# Altium schematic sheet Main.SchDoc
size 381 x 381 mm; SheetNumber: 1; SheetTotal: 1
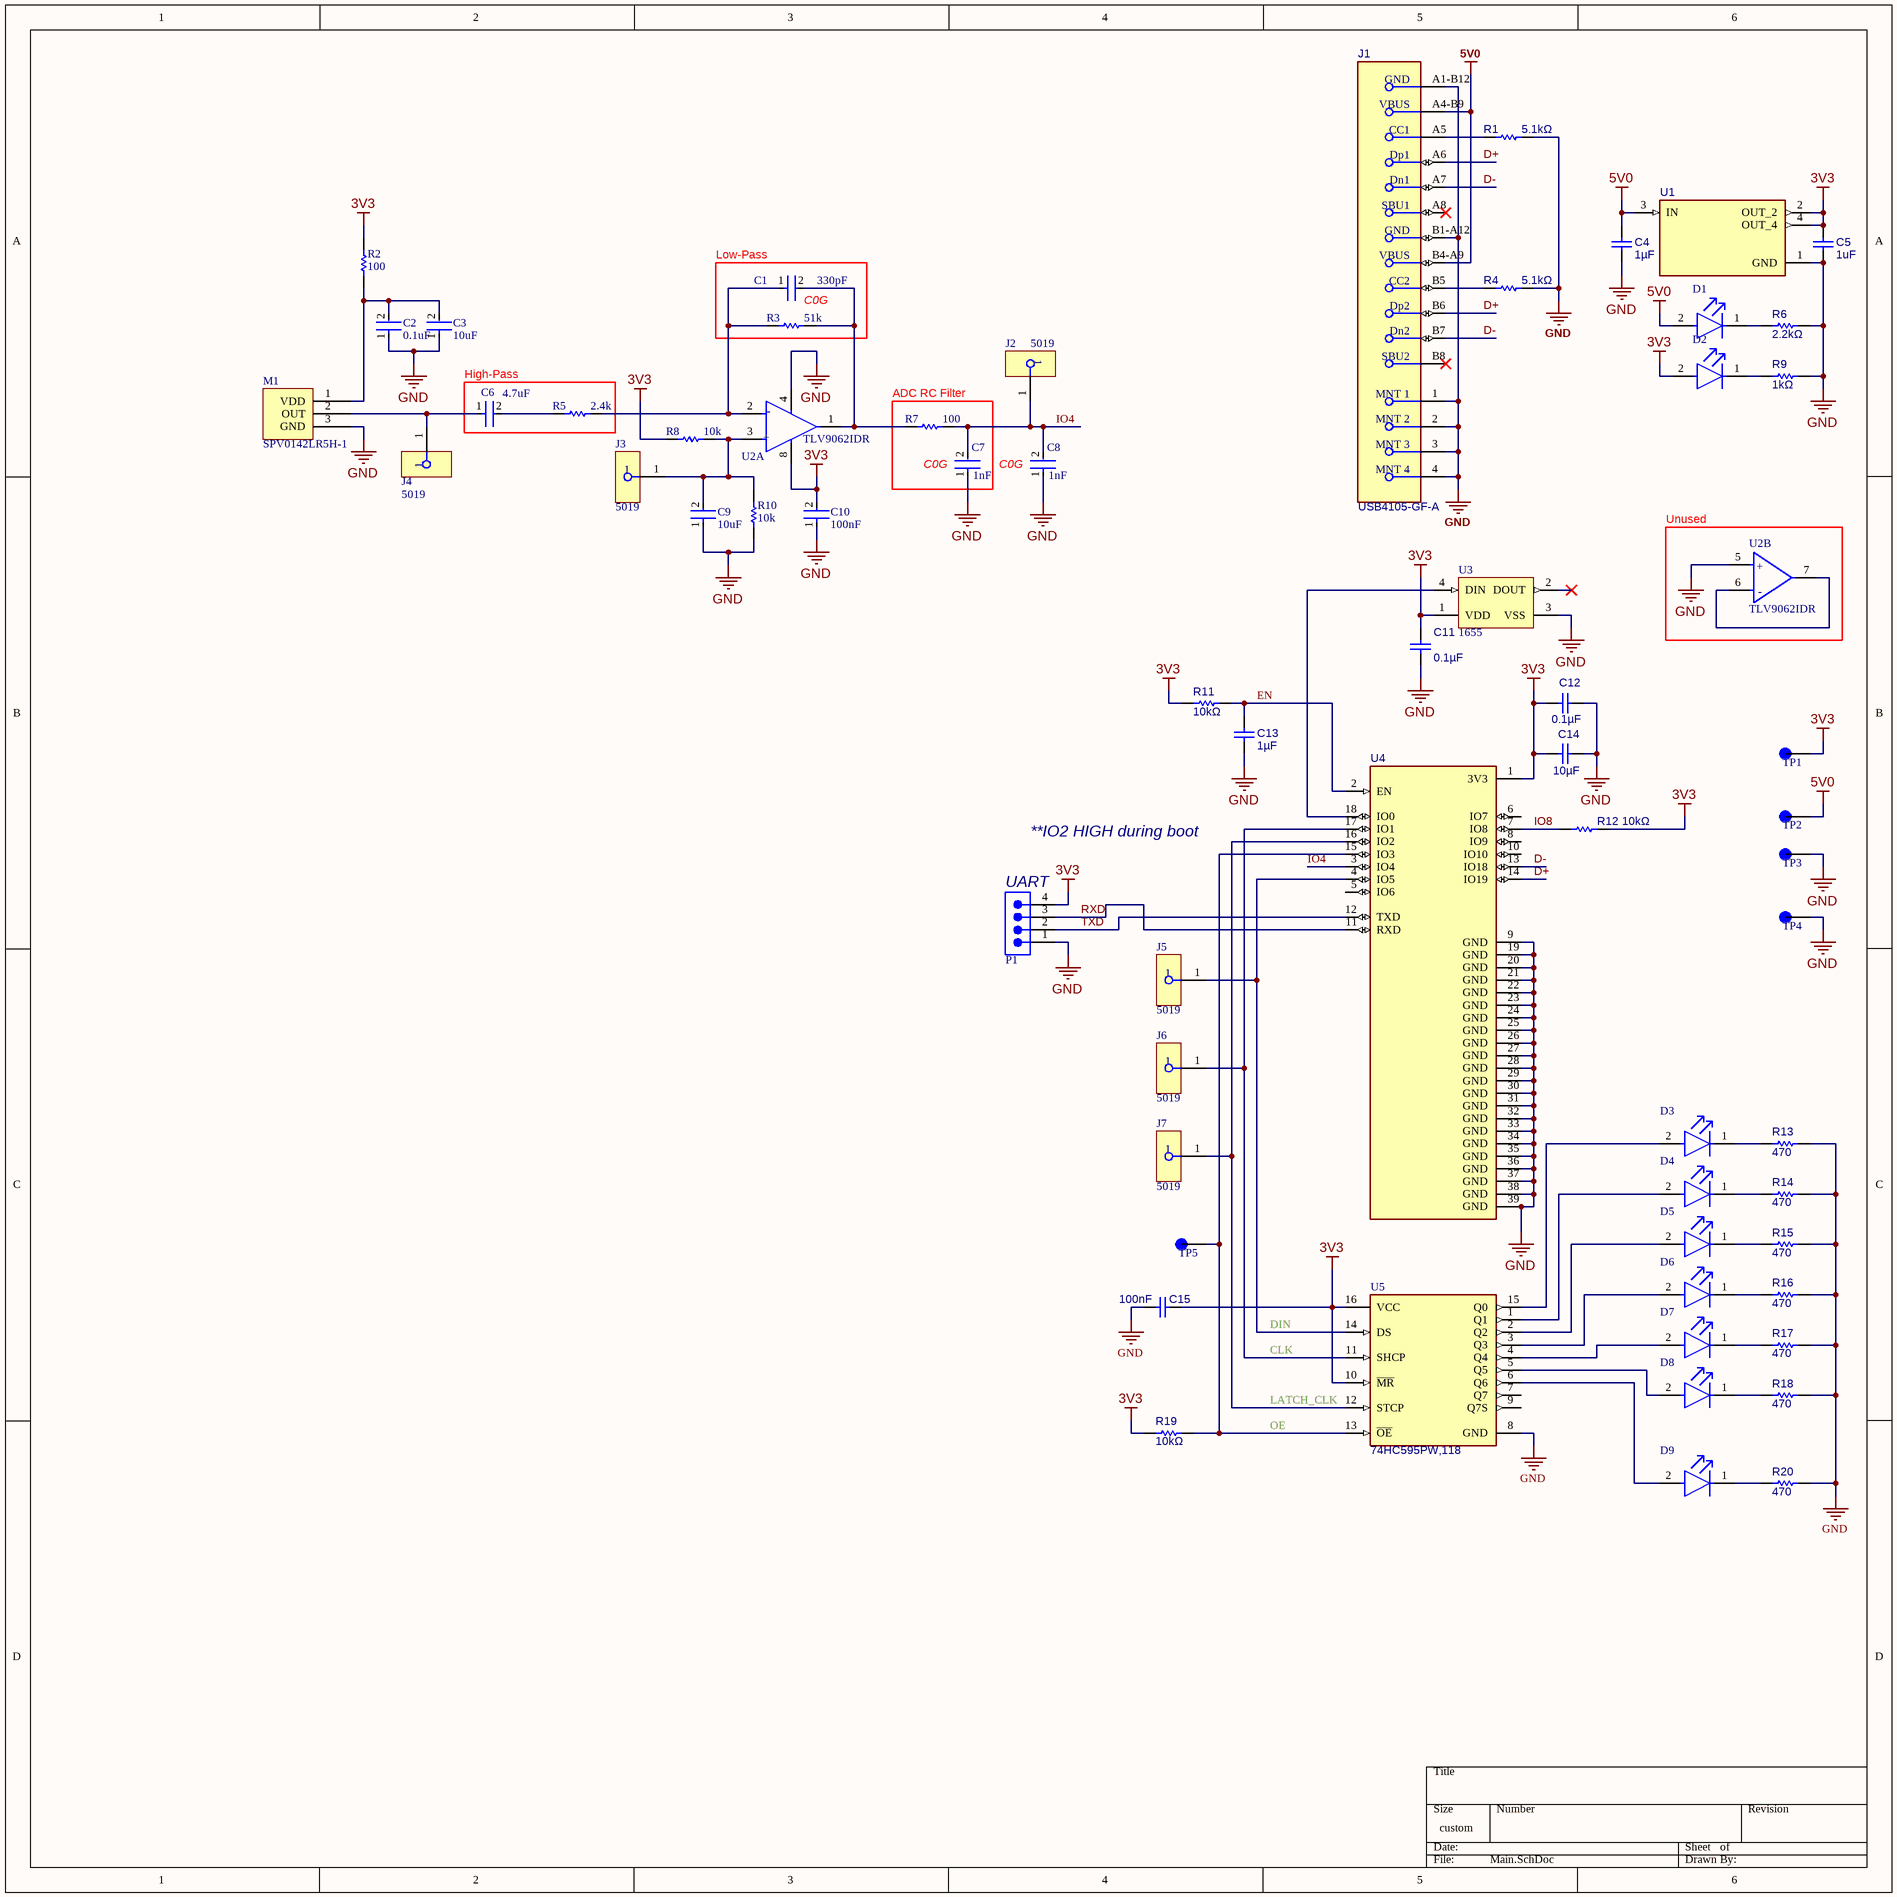
[diagram p0: Main.SchDoc]

## Parts
C1  330pF  [FP-AC1206-0_85-IPC_C]
C2  0.1uF  [FP-AC1206-0_85-IPC_C]
C3  10uF  [FP-AC1206-0_85-IPC_C]
C4  1µF  [WCAP-CSGP_0603_L1.6W0.8H0.8_Reflow]
C5  1uF  [WCAP-CSGP_0603_L1.6W0.8H0.8_Reflow]
C6  4.7uF  [FP-AC1206-0_85-IPC_C]
C7  1nF  [FP-AC1206-0_85-IPC_C]
C8  1nF  [FP-AC1206-0_85-IPC_C]
C9  10uF  [FP-AC1206-0_85-IPC_C]
C10  100nF  [FP-AC1206-0_85-IPC_C]
C11  0.1µF  [WCAP-CSGP_0603_L1.6W0.8H0.8_Reflow]
C12  0.1µF  [WCAP-CSGP_0603_L1.6W0.8H0.8_Reflow]
C13  1µF  [WCAP-CSGP_0603_L1.6W0.8H0.8_Reflow]
C14  10µF  [WCAP-CSGP_0603_L1.6W0.8H0.8_Reflow]
C15  100nF  [WCAP-CSGP_0603_L1.6W0.8H0.8_Reflow]
D1  LTST-C190KGKT  [FP-LTST-C190KGKT-MFG]  (value not drawn)
D2  LTST-C190KGKT  [FP-LTST-C190KGKT-MFG]  (value not drawn)
D3  LTST-C190KGKT  [FP-LTST-C190KGKT-MFG]  (value not drawn)
D4  LTST-C190KGKT  [FP-LTST-C190KGKT-MFG]  (value not drawn)
D5  LTST-C190KGKT  [FP-LTST-C190KGKT-MFG]  (value not drawn)
D6  LTST-C190KGKT  [FP-LTST-C190KGKT-MFG]  (value not drawn)
D7  LTST-C190KGKT  [FP-LTST-C190KGKT-MFG]  (value not drawn)
D8  LTST-C190KGKT  [FP-LTST-C190KGKT-MFG]  (value not drawn)
D9  LTST-C190KGKT  [FP-LTST-C190KGKT-MFG]  (value not drawn)
J1  USB4105-GF-A  [FP-USB4105-GF-A-MFG]
J2  5019  [5019_MFG]
J3  5019  [5019_MFG]
J4  5019  [5019_MFG]
J5  5019  [5019_MFG]
J6  5019  [5019_MFG]
J7  5019  [5019_MFG]
M1  SPV0142LR5H-1  [SPV0142LR5H-1]
P1  61300411121  [61300411121]  (value not drawn)
R1  5.1kΩ  [RESC1608X55X25NL10T15]
R2  100  [RESC3216X70X50NL05T20]
R3  51k  [RESC3216X70X50NL05T20]
R4  5.1kΩ  [RESC1608X55X25NL10T15]
R5  2.4k  [RESC3216X70X50NL05T20]
R6  2.2kΩ  [RESC1608X55X25NL10T15]
R7  100  [RESC3216X70X50NL05T20]
R8  10k  [RESC3216X70X50NL05T20]
R9  1kΩ  [RESC1608X55X25NL10T15]
R10  10k  [RESC3216X70X50NL05T20]
R11  10kΩ  [RESC1608X55X25NL10T15]
R12  10kΩ  [RESC1608X55X25NL10T15]
R13  470  [RESC1608X55X25NL10T15]
R14  470  [RESC1608X55X25NL10T15]
R15  470  [RESC1608X55X25NL10T15]
R16  470  [RESC1608X55X25NL10T15]
R17  470  [RESC1608X55X25NL10T15]
R18  470  [RESC1608X55X25NL10T15]
R19  10kΩ  [RESC1608X55X25NL10T15]
R20  470  [RESC1608X55X25NL10T15]
TP1  1035  [KEYSTONE_1035]  (value not drawn)
TP2  1035  [KEYSTONE_1035]  (value not drawn)
TP3  1035  [KEYSTONE_1035]  (value not drawn)
TP4  1035  [KEYSTONE_1035]  (value not drawn)
TP5  1035  [KEYSTONE_1035]  (value not drawn)
U1  TLV1117LV33DCYR  [VREG_TLV1117LV33DCYR]  (value not drawn)
U2  TLV9062IDR  [FP-D0008A-MFG]  (parts A,B of 2)
U3  1655  [ADA-RGB-1655_V]
U4  ESP32-C3-WROOM-02-N4  [MODULE_ESP32-C3-WROOM-02-H4]  (value not drawn)
U5  74HC595PW,118  [FP-SOT403-1-MFG]

## Blocks framed on the sheet
High-Pass: C6 R5
Unused: U2

## Nets
3V3: C5.2 C10.2 C11.2 C12.1 C14.2 C15.2 D2.2(A) P1.4 R2.2 R8.1 R11.2 R12.1 R19.1 TP1.TP U1.2(OUT_2) U1.4(OUT_4) U2.8(V+) U3.1(VDD) U4.1(3V3) U5.10(~{MR}) U5.16(VCC)
5V0: C4.2 D1.2(A) J1.A4-B9(VBUS) J1.B4-A9(VBUS) TP2.TP U1.3(IN)
GND: C2.1 C3.1 C4.1 C5.1 C7.1 C8.1 C9.1 C10.1 C11.1 C12.2 C13.1 C14.1 C15.1 J1.1(MNT_1) J1.2(MNT_2) J1.3(MNT_3) J1.4(MNT_4) J1.A1-B12(GND) J1.B1-A12(GND) M1.3(GND) P1.1 R1.1 R4.1 R6.1 R9.1 R10.1 R13.1 R14.1 R15.1 R16.1 R17.1 R18.1 R20.1 TP3.TP TP4.TP U1.1(GND) U2.4(V-) U2.5(IN2+) U3.3(VSS) U4.9(GND) U4.19(GND) U4.20(GND) U4.21(GND) U4.22(GND) U4.23(GND) U4.24(GND) U4.25(GND) U4.26(GND) U4.27(GND) U4.28(GND) U4.29(GND) U4.30(GND) U4.31(GND) U4.32(GND) U4.33(GND) U4.34(GND) U4.35(GND) U4.36(GND) U4.37(GND) U4.38(GND) U4.39(GND) U5.8(GND)
CLK: J6.1 U4.17(IO1) U5.11(SHCP)
D+: J1.A6(Dp1) J1.B6(Dp2) U4.14(IO19)
D-: J1.A7(Dn1) J1.B7(Dn2) U4.13(IO18)
DIN: J5.1 U4.4(IO5) U5.14(DS)
EN: C13.2 R11.1 U4.2(EN)
IO4: C7.2 C8.2 J2.1 R7.2 U4.3(IO4)
IO8: R12.2 U4.7(IO8)
LATCH_CLK: J7.1 U4.16(IO2) U5.12(STCP)
OE: R19.2 TP5.TP U4.15(IO3) U5.13(~{OE})
RXD: P1.3 U4.11(RXD)
TXD: P1.2 U4.12(TXD)
NetC1_1: C1.1 R3.1 R5.2 U2.2(IN1-)
NetC1_2: C1.2 R3.2 R7.1 U2.1(OUT1)
NetC2_2: C2.2 C3.2 M1.1(VDD) R2.1
NetC6_1: C6.1 J4.1 M1.2(OUT)
NetC6_2: C6.2 R5.1
NetC9_2: C9.2 J3.1 R8.2 R10.2 U2.3(IN1+)
NetD1_1: D1.1(C) R6.2
NetD2_1: D2.1(C) R9.2
NetD3_1: D3.1(C) R13.2
NetD3_2: D3.2(A) U5.15(Q0)
NetD4_1: D4.1(C) R14.2
NetD4_2: D4.2(A) U5.1(Q1)
NetD5_1: D5.1(C) R15.2
NetD5_2: D5.2(A) U5.2(Q2)
NetD6_1: D6.1(C) R16.2
NetD6_2: D6.2(A) U5.3(Q3)
NetD7_1: D7.1(C) R17.2
NetD7_2: D7.2(A) U5.4(Q4)
NetD8_1: D8.1(C) R18.2
NetD8_2: D8.2(A) U5.5(Q5)
NetD9_1: D9.1(C) R20.2
NetD9_2: D9.2(A) U5.6(Q6)
NetJ1_A5: J1.A5(CC1) R1.2
NetJ1_B5: J1.B5(CC2) R4.2
NetU2_6: U2.6(IN2-) U2.7(OUT2)
NetU3_4: U3.4(DIN) U4.18(IO0)

Not connected (* = marked no-connect by the designer): J1 A8(SBU1)* B8(SBU2)*; U3 2(DOUT)*; U4 5(IO6) 6(IO7) 8(IO9) 10(IO10); U5 7(Q7) 9(Q7S)

## Notes on the sheet
- (near C1) Low-Pass
- C0G
- (near R7) ADC RC Filter
- **IO2 HIGH during boot
- (near P1) UART
- (in symbol CMP-04895-000302-1, part A) -; +
- (in symbol CMP-04895-000302-1, part B) +; -

## Library data of the parts
C1-C3 C6-C10 = CMP-03422-000551-1: AC1206 22 nF X7R 10.00% 100 V; Manufacturer: Yageo; Manufacturer Part Number: AC1206KRX7R0BB223; Capacitance: 22 nF; Voltage Rating: 100 V; Automotive Grade: Grade 1; Value: 22 nF; Temperature Coefficient: 15%; Material: Ceramic; Tolerance: 0.1; Device Class L2: Capacitors; Device Class L3: Ceramic Capacitors; Package: AC1206-0.85; Device Class L1: Passive Components; Height: 0.95mm; Automotive: Yes; Ipc Land Pattern Name: CAPC320160X85; Temperature Range High: +125°C; Lead Free: Yes; Temperature Range Low: -55°C; ComponentLink2URL: http://www.yageo.com/documents/recent/UPY-AC_NP0X7R_16V-to-630V_12.pdf; Temperature Characteristic: X7R; ComponentLink2Description: Datasheet; Category: Cap; RoHS: TRUE; Footprint Url: http://www.yageo.com/exep/pages/download/literatures/UPY-C_GEN_24.pdf; Temperature: -55°C to +125°C; Octopart: https://octopart.com/ac1206krx7r0bb223-yageo-78873672
C4 C5 C11-C15 = CMP-207839-000060-3: 10V tolerance
D1-D9 = CMP-2000-05197-2: LED GREEN CLEAR CHIP SMD; Test Current: 20mA; Power Rating: 75mW; Forward Voltage: 2V; Wavelength: 574nm; Number of LEDs: 1; Reverse Voltage: 5V; Dominant Wavelength: 571nm; Lens Style: Diffused; Luminous Intensity: 35mcd; Forward Current: 30mA; Viewing Angle: 130°; Lens Color: Colorless; Width: 0.8mm; Case Code (Imperial): 0603; Case Code (Metric): 1608; Number of Pins: 2; Radiation Hardening: No; Package Quantity: 1; Lead Free: Lead Free; Lens Transparency: Clear; Depth: 0.8mm; Power Dissipation: 75mW; Mount: Surface Mount; Max Operating Temperature: 85°C; Case/Package: 0603; Height: 0.8mm; Illumination Color: Green; Color: Green; Length: 1.6mm; Packaging: Tape and Reel; Number of Elements: 1; Min Operating Temperature: -55°C
J1 = CMP-245163-000001-1: CONN RCPT USB2.0 TYPEC 5A; Manufacturer: GCT; Voltage Rating: 20V; Is Female: yes; Current Rating: 5/6.25/1.25/0.25A; Number Of Contacts: 16; Conn Orientation: Right Angle; Device Class L1: Connectors; Category: Conn; Lead Free: Yes; RoHS: TRUE; Temperature Range High: +85°C; Digikey Description: CONN RCPT USB2.0 TYPEC 5A; Device Class L3: unset; ComponentLink2Description: Datasheet; Manufacturer Part Number: USB4105-GF-A; Package: 0; Usb Standard: USB 2.0; Device Class L2: USB Connectors; Automotive: No; Temperature Range Low: -40°C; Height: 3.46mm; Temperature: -40°C to +85°C; Contact Material: Gold,Nickel; ComponentLink2URL: https://gct.co/files/drawings/usb4105.pdf; Octopart: https://octopart.com/usb4105-gf-a-gct-106627878
J2-J7 = CMP-1672-00008-3: Phosphor Bronze Contact Miniature Silver Plated Surface Mount Test Points; Number of Contacts: 1; ComponentLink1Description: Manufacturer's Website; Number of Pins: 1; Height: 2.42mm; Mount: Surface Mount; HelpURL: https://www.keyelco.com/product-pdf.cfm?p=1357; REACH SVHC: Yes; Packaging: Tape and Reel; Lead Free: Lead Free; ComponentLink1URL: http://www.keyelco.com/; Termination: SMD/SMT; Material: Bronze; Contact Plating: Silver; Contact Material: Silver; RoHS: Compliant; ComponentLink2URL: https://www.keyelco.com/product-pdf.cfm?p=1357; China RoHS: Compliant; Lifecycle Status: Production; ComponentLink2Description: Datasheet URL
P1 = CMP-1502-01064-4: THT Vertical Pin Header WR-PHD, Pitch 2.54 mm, Single Row, 4 pins; Connector Type: Male Pin; Gender: Male; Current Rating: 3A; Number of Positions: 4; Operating Supply Voltage: 250V; Contact Resistance: 20mΩ; Pitch: 2.54mm; Max Operating Temperature: 105°C; Mount: Through Hole; Contact Material: Gold; Contact Plating: Gold; Number of Contacts: 4; Orientation: Vertical; Packaging: Bulk; Contact Mating Length: 5.9944mm; Voltage Rating: 250V; Number of Rows: 1; Height: 8.89mm; Lead Free: Lead Free; Lead Pitch: 2.54mm; Number of Pins: 4; Color: Black; Min Operating Temperature: -40°C; RoHS: Compliant; Termination: Solder
R1 R4 R6 R9 R11-R20 = CMP-2000-04186-1
R2 R3 R5 R7 R8 R10 = CMP-2003-00307-1: Part Number: ERJ8ENF3300V; Manufacturer: Panasonic
TP1-TP5 = 1035: Test Point PC Slotted THM Height .335 Brass/Tin | Keystone Electronics 1035; SnapEDA_Link: https://www.snapeda.com/parts/1035/Keystone/view-part/?ref=snap; Package: None; Value: *; MF: Keystone Electronics; MP: 1035; Check_prices: https://www.snapeda.com/parts/1035/Keystone/view-part/?ref=eda
U1 = TLV1117LV33DCYR: 1-A, low-dropout voltage regulator; MF: Texas Instruments; Check_prices: https://www.snapeda.com/parts/TLV1117LV33DCYR/Texas+Instruments/view-part/?ref=eda; Value: *; MP: TLV1117LV33DCYR; Purchase-URL: https://pricing.snapeda.com/search/part/TLV1117LV33DCYR/?ref=eda; SnapEDA_Link: https://www.snapeda.com/parts/TLV1117LV33DCYR/Texas+Instruments/view-part/?ref=snap; Package: SOT-223-4 Texas Instruments; Digi-Key_Part_Number: 296-28778-2-ND
U2 = CMP-04895-000302-1: IC CMOS 2 CIRCUIT 8SOIC; Slew Rate: 6.5V/µs; Number of Channels: 2; Input Offset Voltage (Vos): 300uV; Input Bias Current: 0.5pA; Output Current per Channel: 50mA; Gain Bandwidth Product: 10MHz; Operating Supply Current: 538uA; RoHS Compliant: Yes; Case/Package: SOIC; Number of Circuits: 2; Number of Pins: 8; Mount: Surface Mount; Max Operating Temperature: 125°C; Min Operating Temperature: -40°C; Packaging: Tape and Reel
U3 = CMP-2000-05026-1: Intelligent Control LED Integrated Light Source, 3.5 to 5.3 V, -25 to 80 degC, 4-Pin SMD, RoHS, Tape and Reel; Manufacturer: Adafruit-Industries-LLC; Number of LEDs: 10; Configuration: Discrete; Utilized LED: WS2812(5050); Datasheet URL: http://datasheet.octopart.com/ADA1655-Adafruit-Industries-datasheet-32028139.pdf; Series: Neopixel; Interface: -; Package Description: 4-Pin Surface Mount Device, Body 5 x 5 mm; Color: Red,Green,Blue(RGB); Category: Optoelectronics; Controller Type: -; Package Reference: 1655; Manufacturer URL: https://www.adafruit.com/; Mounting Type: SurfaceMount; Datasheet Version: May-13; Size / Dimension: 5.00mmLx5.00mmW; Family: Addressable,Specialty
U4 = ESP32-C3-WROOM-02-N4: WiFi Modules (802.11) (Engineering Samples) SMD module, ESP32-C3, 4MB SPI flash, PCB antenna, -40 C +85 C; MF: Espressif Systems; Value: *; SnapEDA_Link: https://www.snapeda.com/parts/ESP32-C3-WROOM-02-N4/Espressif+Systems/view-part/?ref=snap; Purchase-URL: https://pricing.snapeda.com/search/part/ESP32-C3-WROOM-02-N4/?ref=eda; Availability: In Stock; Price: None; Package: Package; Check_prices: https://www.snapeda.com/parts/ESP32-C3-WROOM-02-N4/Espressif+Systems/view-part/?ref=eda; MP: ESP32-C3-WROOM-02-N4
U5 = CMP-14351-000004-1: IC SHIFT REGISTER 8BIT 16TSSOP